# EAGLE design Right bottom 4 leds (EAGLE 8.2.0)
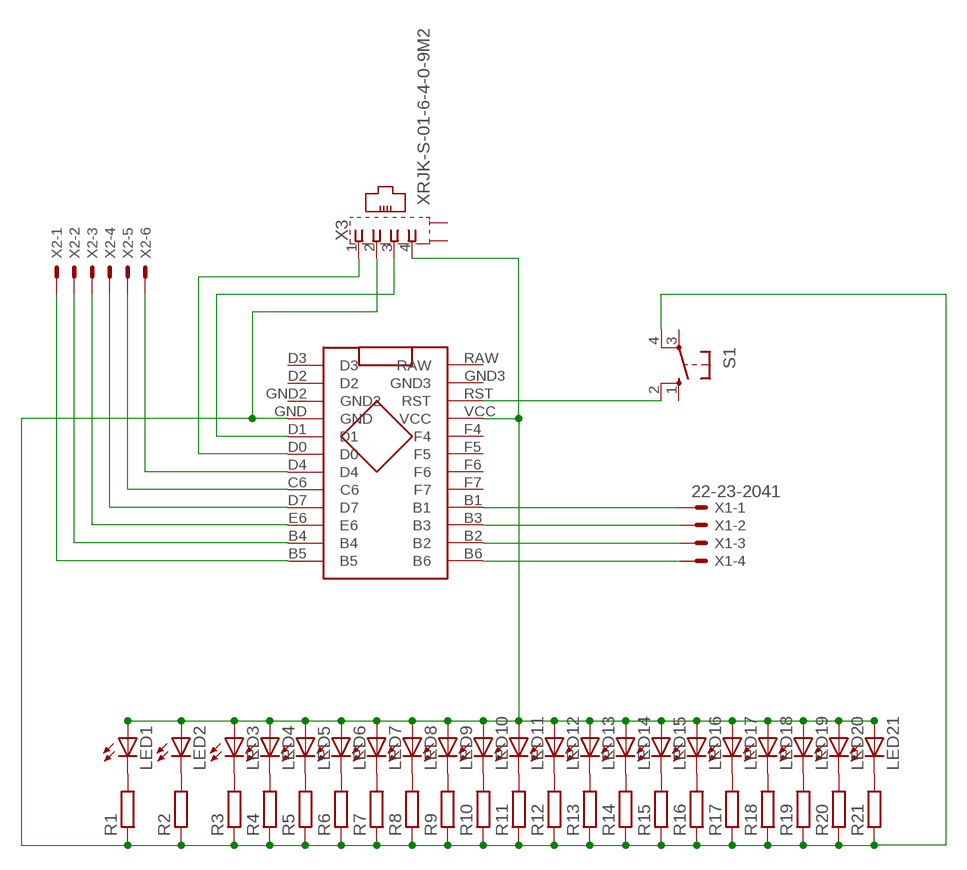
[diagram p0: schematic, sheet 1]

## Parts
LED1  LED3MM  [LED3MM]
LED2  LED3MM  [LED3MM]
LED3  LED3MM  [LED3MM]
LED4  LED3MM  [LED3MM]
LED5  LED3MM  [LED3MM]
LED6  LED3MM  [LED3MM]
LED7  LED3MM  [LED3MM]
LED8  LED3MM  [LED3MM]
LED9  LED3MM  [LED3MM]
LED10  LED3MM  [LED3MM]
LED11  LED3MM  [LED3MM]
LED12  LED3MM  [LED3MM]
LED13  LED3MM  [LED3MM]
LED14  LED3MM  [LED3MM]
LED15  LED3MM  [LED3MM]
LED16  LED3MM  [LED3MM]
LED17  LED3MM  [LED3MM]
LED18  LED3MM  [LED3MM]
LED19  LED3MM  [LED3MM]
LED20  LED3MM  [LED3MM]
LED21  LED3MM  [LED3MM]
R1  R-EU_0204/7  [0204/7]
R2  R-EU_0204/7  [0204/7]
R3  R-EU_0204/7  [0204/7]
R4  R-EU_0204/7  [0204/7]
R5  R-EU_0204/7  [0204/7]
R6  R-EU_0204/7  [0204/7]
R7  R-EU_0204/7  [0204/7]
R8  R-EU_0204/7  [0204/7]
R9  R-EU_0204/7  [0204/7]
R10  R-EU_0204/7  [0204/7]
R11  R-EU_0204/7  [0204/7]
R12  R-EU_0204/7  [0204/7]
R13  R-EU_0204/7  [0204/7]
R14  R-EU_0204/7  [0204/7]
R15  R-EU_0204/7  [0204/7]
R16  R-EU_0204/7  [0204/7]
R17  R-EU_0204/7  [0204/7]
R18  R-EU_0204/7  [0204/7]
R19  R-EU_0204/7  [0204/7]
R20  R-EU_0204/7  [0204/7]
R21  R-EU_0204/7  [0204/7]
S1  10-XX  [B3F-10XX]
U$1  ARDUINO_PRO_MICRO_HECTOR  [ARDUINO_PRO_MICRO_HECTOR]
X1  22-23-2041  [22-23-2041]
X2  22-23-2061  [22-23-2061]
X3  XRJK-S-01-6-4-0-9M2  [XRJK-S-01-6-4-0-9M2]

## Nets
N$1: LED3.K(C) R3.2
N$2: LED4.K(C) R4.2
N$3: LED5.K(C) R5.2
N$4: LED2.K(C) R2.2
N$5: LED1.K(C) R1.2
N$6: LED6.K(C) R6.2
N$7: LED7.K(C) R7.2
N$8: LED8.K(C) R8.2
N$9: LED9.K(C) R9.2
N$10: LED10.K(C) R10.2
N$11: LED11.K(C) R11.2
N$12: LED12.K(C) R12.2
N$13: LED13.K(C) R13.2
N$14: LED14.K(C) R14.2
N$15: LED15.K(C) R15.2
N$16: LED16.K(C) R16.2
N$17: LED17.K(C) R17.2
N$18: LED18.K(C) R18.2
N$19: LED19.K(C) R19.2
N$20: LED20.K(C) R20.2
N$21: LED21.K(C) R21.2
N$22: S1.2(S1) U$1.RST
N$26: U$1.B5 X2.1
N$27: U$1.B4 X2.2
N$28: U$1.E6 X2.3
N$29: U$1.D7 X2.4
N$30: U$1.C6 X2.5
N$31: U$1.D4 X2.6
N$32: U$1.D0 X3.1
N$33: U$1.D1 X3.3
N$34: R1.1 R2.1 R3.1 R4.1 R5.1 R6.1 R7.1 R8.1 R9.1 R10.1 R11.1 R12.1 R13.1 R14.1 R15.1 R16.1 R17.1 R18.1 R19.1 R20.1 R21.1 S1.4(P1) U$1.GND X3.2
N$35: LED1.A LED2.A LED3.A LED4.A LED5.A LED6.A LED7.A LED8.A LED9.A LED10.A LED11.A LED12.A LED13.A LED14.A LED15.A LED16.A LED17.A LED18.A LED19.A LED20.A LED21.A U$1.VCC X3.4
N$37: U$1.B6 X1.4
N$38: U$1.B2 X1.3
N$39: U$1.B3 X1.2
N$40: U$1.B1 X1.1
Unconnected: S1.1(S) S1.3(P) U$1.D2 U$1.D3 U$1.F4 U$1.F5 U$1.F6 U$1.F7 U$1.GND2 U$1.GND3 U$1.RAW X3.S1(S) X3.S2(S)

## Library data of the parts
LED1-LED21 = led:LED: LED OSRAM: - CHIPLED LG R971, LG N971, LY N971, LG Q971, LY Q971, LO R971, LY R971 LH N974, LH R974 LS Q976, LO Q976, LY Q976 LO Q996 - Hyper CHIPLED LW Q18S LB Q993, LB Q99A, LB R99A - SideLED LS A670, LO A670, LY A670, LG A670, LP A670 LB A673, LV A673, LT A673, LW A673 LH A674 LY A675 LS A676, LA A676, LO A676, LY A676, LW A676 LS A679, LY A679, LG A679 - Hyper Micro SIDELED® LS Y876, LA Y876, LO Y876, LY Y876 LT Y87S - SmartLED LW L88C, LW L88S LB L89C, LB L89S, LG L890 LS L89K, LO L89K, LY L89K LS L896, LA L896, LO L896, LY L896 - TOPLED LS T670, LO T670, LY T670, LG T670, LP T670 LSG T670, LSP T670, LSY T670, LOP T670, LYG T670 LG T671, LOG T671, LSG T671 LB T673, LV T673, LT T673, LW T673 LH T674 LS T676, LA T676, LO T676, LY T676, LB T676, LH T676, LSB T676, LW T676 LB T67C, LV T67C, LT T67C, LS T67K, LO T67K, LY T67K, LW E67C LS E67B, LA E67B, LO E67B, LY E67B, LB E67C, LV E67C, LT E67C LW T67C LS T679, LY T679, LG T679 LS T770, LO T770, LY T770, LG T770, LP T770 LB T773, LV T773, LT T773, LW T773 LH T774 LS E675, LA E675, LY E675, LS T675 LS T776, LA T776, LO T776, LY T776, LB T776 LHGB T686 LT T68C, LB T68C - Hyper Mini TOPLED® LB M676 - Mini TOPLED Santana® LG M470 LS M47K, LO M47K, LY M47K Source: http://www.osram.convergy.de LUXEON: - LUMILED® LXK2-PW12-R00, LXK2-PW12-S00, LXK2-PW14-U00, LXK2-PW14-V00 LXK2-PM12-R00, LXK2-PM12-S00, LXK2-PM14-U00 LXK2-PE12-Q00, LXK2-PE12-R00, LXK2-PE12-S00, LXK2-PE14-T00, LXK2-PE14-U00 LXK2-PB12-K00, LXK2-PB12-L00, LXK2-PB12-M00, LXK2-PB14-N00, LXK2-PB14-P00, LXK2-PB14-Q00 LXK2-PR12-L00, LXK2-PR12-M00, LXK2-PR14-Q00, LXK2-PR14-R00 LXK2-PD12-Q00, LXK2-PD12-R00, LXK2-PD12-S00 LXK2-PH12-R00, LXK2-PH12-S00 LXK2-PL12-P00, LXK2-PL12-Q00, LXK2-PL12-R00 Source: www.luxeon.com KINGBRIGHT: KA-3528ASYC Source: www.kingbright.com
R1-R21 = rcl:R-EU_: RESISTOR, European symbol
S1 = switch-omron:10-XX: OMRON SWITCH; MPN: B3F-1000; OC_FARNELL: 176432; OC_NEWARK: 36M3542
U$1 = Arduino pro micro hector:ARDUINO_PRO_MICRO_HECTOR
X1 = con-molex:22-23-2041: .100" (2.54mm) Center Header - 4 Pin; MF: MOLEX; MPN: 22-23-2041; OC_FARNELL: 1462920; OC_NEWARK: 38C0355
X2 = con-molex:22-23-2061: .100" (2.54mm) Center Header - 6 Pin; MF: MOLEX; MPN: 22-23-2061; OC_FARNELL: 1462922; OC_NEWARK: 27C1933
X3 = con-xmultiple:XRJK*4: RJ11 Connector without LED, 6 position, 4 contacts, thrue hole Source: XRJK-S-01-6-4-0-9M2(01).pdf

## Board
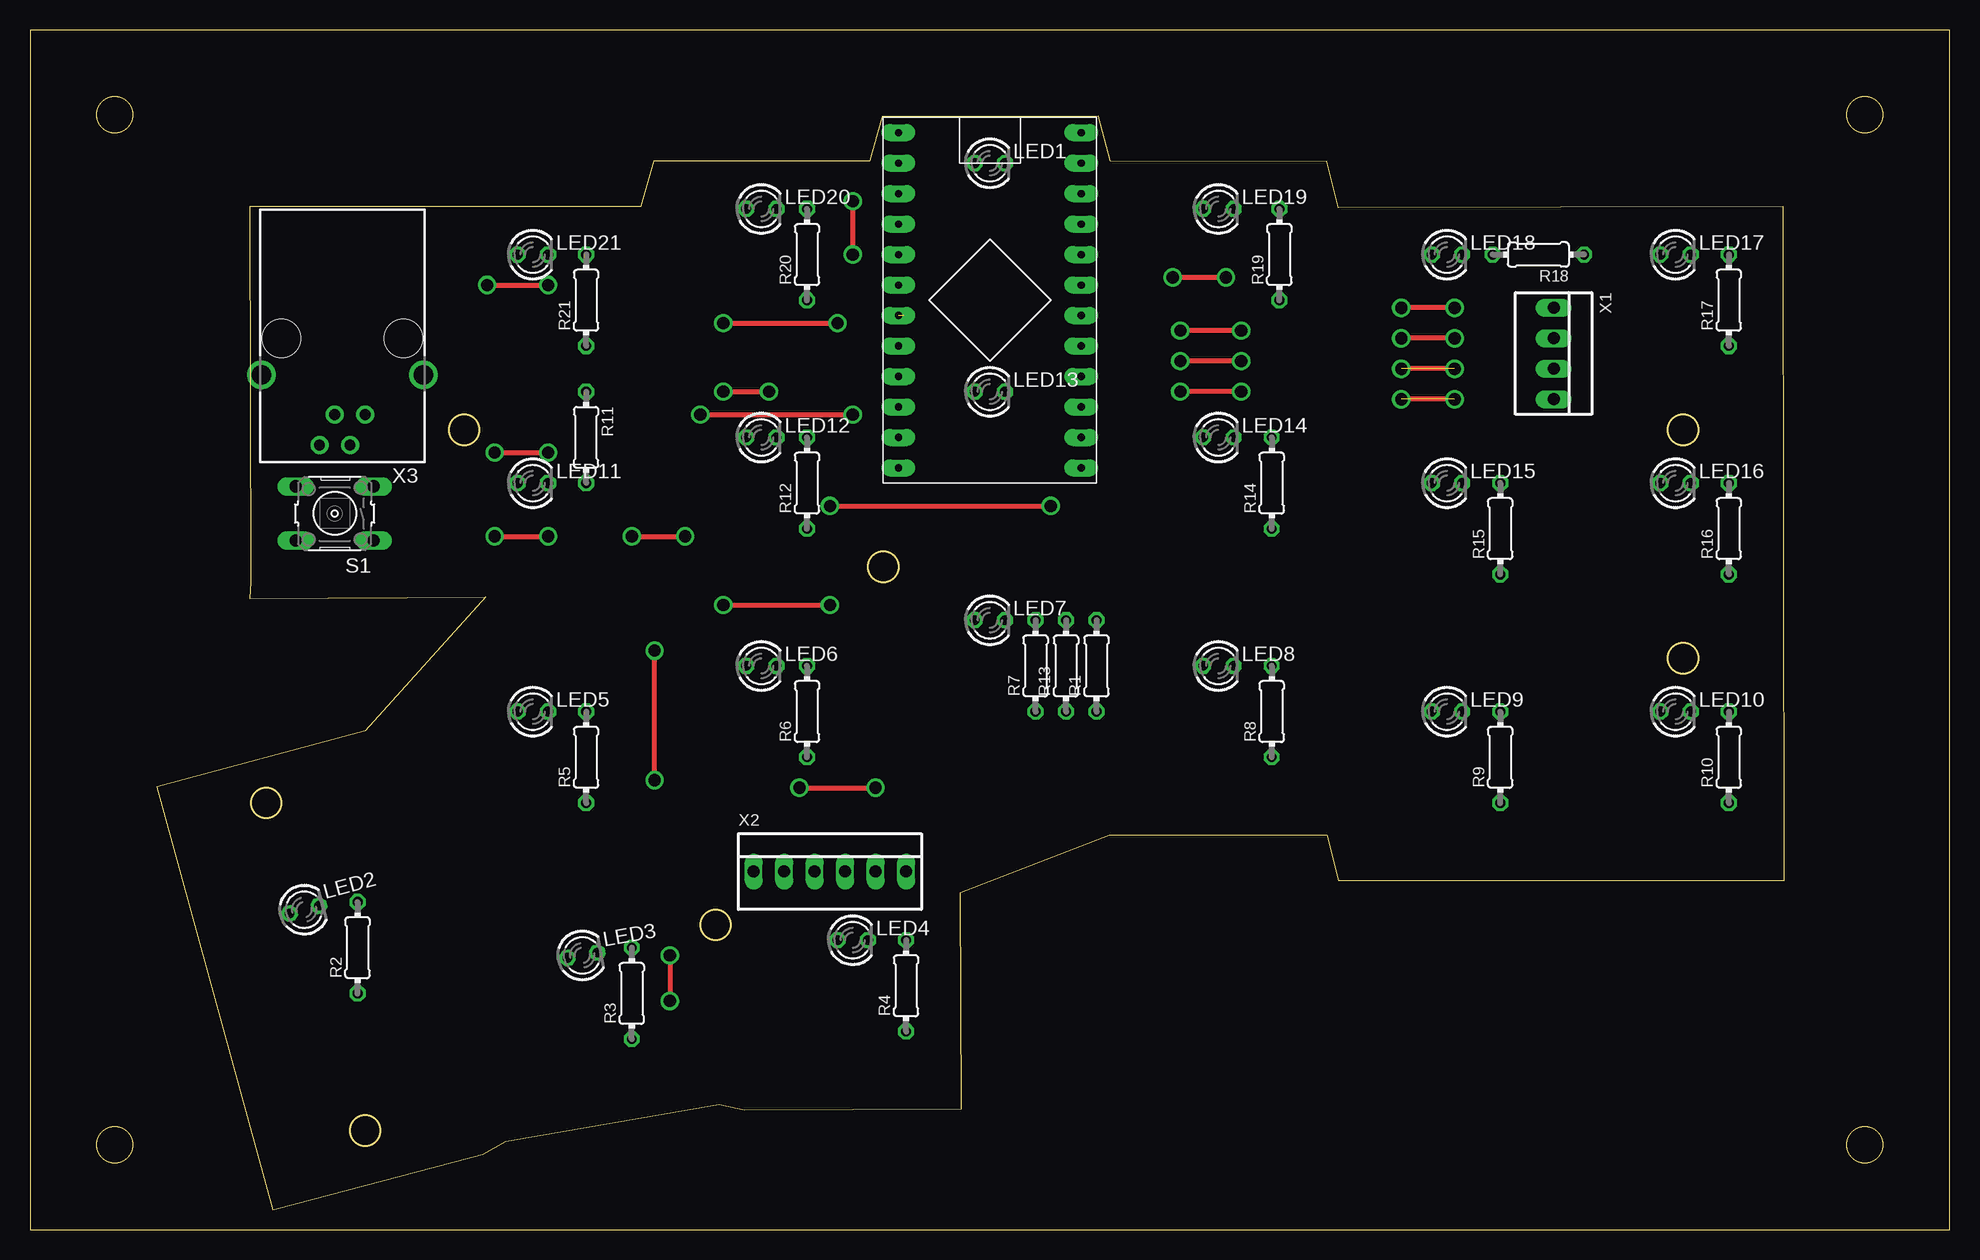
[diagram p1: board, top side]
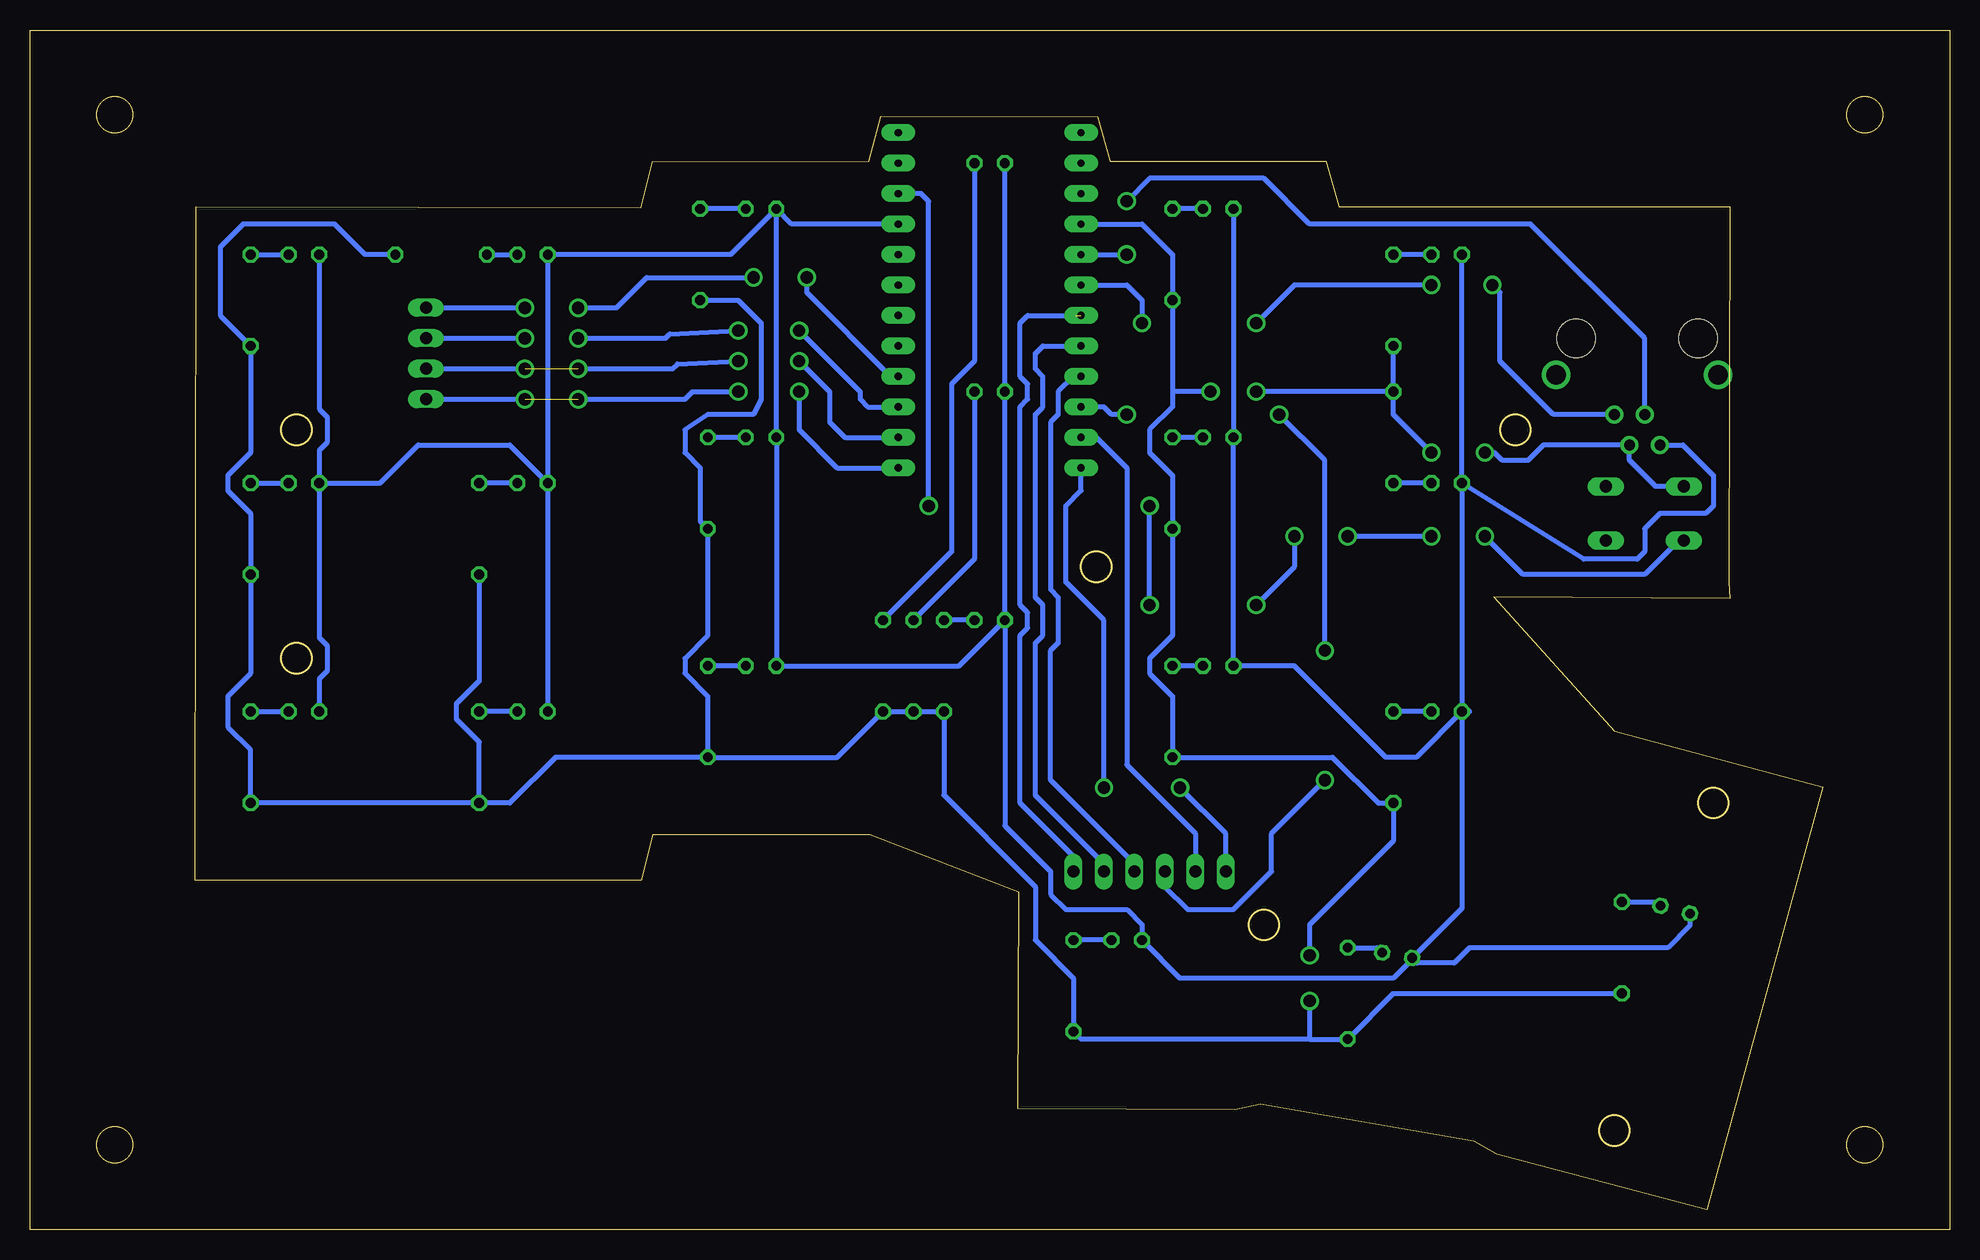
[diagram p2: board, bottom side, seen from below]

Size 160 x 100 mm. Coordinates in mm from the lower left corner, seen from the top.
Outline: 0,0 160,0 160,100 0,100 0,0
Outline: 20.25,1.66 37.71,6.28 39.63,7.34 57.43,10.42 59.58,9.99 77.64,10.05 77.58,28.11 90,32.91 108.12,32.91 109.05,29.1 146.22,29.1 146.16,85.26 109.05,85.2 108.12,89.01 90.06,89.07 89.07,92.82 71.01,92.76 69.96,89.07 51.96,89.07 50.91,85.26 18.3,85.26 18.41,53.98 18.3,52.59 37.99,52.73 27.94,41.56 10.55,36.91 20.25,1.66
Outline: circle at 7.07,92.93 radius 1.5
Outline: circle at 7.07,7.07 radius 1.5
Outline: circle at 152.93,7.07 radius 1.5
Outline: circle at 152.93,92.93 radius 1.5
Outline: circle at 71.12,55.24 radius 1.27
Outline: circle at 137.79,66.67 radius 1.27
Outline: circle at 137.79,47.62 radius 1.27
Outline: circle at 36.2,66.67 radius 1.27
Outline: circle at 19.68,35.56 radius 1.27
Outline: circle at 27.94,8.26 radius 1.27
Outline: circle at 57.15,25.4 radius 1.27
Copper layers (1*16): Top 0.035mm / dielectric 1.5mm / Bottom 0.035mm
Design rules "default *": minimum track width 6mil, minimum drill 0.35mm, track to track 12mil, track to pad 12mil, pad to pad 12mil, via to via 12mil, smd to smd 12mil, copper to edge 40mil, drill to drill 6mil, minimum pad ring 10mil, minimum via ring 8mil, stop-mask expansion 4mil, vias tented up to drill 0mil, thermal gap 10mil

### Footprints (pad centres in the part's own frame; a part is rotated, then mirrored left to right if it is on the bottom)
LED3MM = drill 0.813 octagon: A -1.27,0; K 1.27,0
0204/7 = drill 0.813 octagon: 1 -3.81,0; 2 3.81,0
B3F-10XX = drill 1.016 long: 1 -3.251,2.261; 2 3.251,2.261; 3 -3.251,-2.261; 4 3.251,-2.261
ARDUINO_PRO_MICRO_HECTOR = drill 0.6 pad 1.422 long: B1 10.16,-5.08; B2 10.16,-10.16; B3 10.16,-7.62; B4 -5.08,-10.16; B5 -5.08,-12.7; B6 10.16,-12.7; C6 -5.08,-2.54; D0 -5.08,2.54; D1 -5.08,5.08; D2 -5.08,12.7; D3 -5.08,15.24; D4 -5.08,0; D7 -5.08,-5.08; E6 -5.08,-7.62; F4 10.16,5.08; F5 10.16,2.54; F6 10.16,0; F7 10.16,-2.54; GND -5.08,7.62; GND2 -5.08,10.16; GND3 10.16,12.7; RAW 10.16,15.24; RST 10.16,10.16; VCC 10.16,7.62
22-23-2041 = drill 1 long: 1 -3.81,0; 2 -1.27,0; 3 1.27,0; 4 3.81,0
22-23-2061 = drill 1 long: 1 -6.35,0; 2 -3.81,0; 3 -1.27,0; 4 1.27,0; 5 3.81,0; 6 6.35,0
XRJK-S-01-6-4-0-9M2 = drill 0.9 pad 1.5: 1 -1.905,6.35; 2 -0.635,8.89; 3 0.635,6.35; 4 1.905,8.89 | drill 1.6 pad 2.184: S1 -6.75,3.05; S2 6.75,3.05 | hole 3.2: -5.08,0; 5.08,0

### Placement (x,y rotation side)
LED1  80.01,88.9 0 top
LED2  22.86,26.67 15 top
LED3  46.04,22.86 10 top
LED4  68.58,24.13 0 top
LED5  41.91,43.18 0 top
LED6  60.96,46.99 0 top
LED7  80.01,50.8 0 top
LED8  99.06,46.99 0 top
LED9  118.11,43.18 0 top
LED10  137.16,43.18 0 top
LED11  41.91,62.23 0 top
LED12  60.96,66.04 0 top
LED13  80.01,69.85 0 top
LED14  99.06,66.04 0 top
LED15  118.11,62.23 0 top
LED16  137.16,62.23 0 top
LED17  137.16,81.28 0 top
LED18  118.11,81.28 0 top
LED19  99.06,85.09 0 top
LED20  60.96,85.09 0 top
LED21  41.91,81.28 0 top
R1  88.9,46.99 90 top
R2  27.3,23.5 90 top
R3  50.16,19.68 90 top
R4  73.03,20.32 90 top
R5  46.35,39.37 90 top
R6  64.77,43.18 90 top
R7  83.82,46.99 90 top
R8  103.5,43.18 90 top
R9  122.56,39.37 90 top
R10  141.6,39.37 90 top
R11  46.35,66.04 270 top
R12  64.77,62.23 90 top
R13  86.36,46.99 90 top
R14  103.5,62.23 90 top
R15  122.56,58.42 90 top
R16  141.6,58.42 90 top
R17  141.6,77.47 90 top
R18  125.73,81.28 180 top
R19  104.14,81.28 90 top
R20  64.77,81.28 90 top
R21  46.35,77.47 90 top
S1  25.4,59.69 180 top
U$1  77.47,76.2 0 top
X1  127,73.03 270 top
X2  66.67,29.84 0 top
X3  26.04,74.3 180 top

### Tracks (layer width: path | path; a pad name or v marks a point on that pad's centre or on a via)
N$1
  Bottom 0.406: R3.2 47.7,23.5 LED3.K
N$2
  Bottom 0.406: LED4.K R4.2
N$3
  Bottom 0.406: LED5.K R5.2
N$4
  Bottom 0.406: R2.2 24.39,27.3 LED2.K
N$5
  Bottom 0.406: LED1.K 81.28,72.39 83.19,70.48 83.19,56.52 R1.2
N$6
  Bottom 0.406: LED6.K R6.2
N$7
  Bottom 0.406: LED7.K R7.2
N$8
  Bottom 0.406: LED8.K R8.2
N$9
  Bottom 0.406: LED9.K R9.2
N$10
  Bottom 0.406: R10.2 LED10.K
N$11
  Bottom 0.406: LED11.K R11.2
N$12
  Bottom 0.406: LED12.K R12.2
N$13
  Bottom 0.406: LED13.K 81.28,55.88 R13.2
N$14
  Bottom 0.406: LED14.K R14.2
N$15
  Bottom 0.406: LED15.K R15.2
N$16
  Bottom 0.406: R16.2 LED16.K
N$17
  Bottom 0.406: R17.2 LED17.K
N$18
  Bottom 0.406: R18.2 LED18.K
N$19
  Bottom 0.406: LED19.K R19.2
N$20
  Bottom 0.406: LED20.K R20.2
N$21
  Bottom 0.406: LED21.K R21.2
N$22  (via drill 1.02)
  Top 0.406: v38.73,57.78 v43.18,57.78 | v50.16,57.78 v54.61,57.78 | v57.78,52.07 v66.67,52.07 | v66.67,60.33 v85.09,60.33
  Bottom 0.406: S1.2 22.58,57.43 25.4,54.61 35.56,54.61 v38.73,57.78 | v43.18,57.78 v50.16,57.78 | v54.61,57.78 54.61,55.24 v57.78,52.07 | v66.67,52.07 v66.67,60.33 | v85.09,60.33 85.09,85.72 85.72,86.36 U$1.RST
N$23  (2 unrouted)
N$24  (1 unrouted)
N$26  (via drill 1.02)
  Top 0.406: v64.14,36.83 v70.48,36.83
  Bottom 0.406: X2.1 60.33,33.02 v64.14,36.83 | v70.48,36.83 70.48,50.8 73.66,53.98 73.66,60.33 72.39,61.59 U$1.B5
N$27
  Bottom 0.406: U$1.B4 71.12,66.04 68.58,63.5 68.58,38.73 62.87,33.02 X2.2
N$28  (via drill 1.02)
  Top 0.406: v52.07,37.47 v52.07,48.26 | v55.88,67.94 v68.58,67.94
  Bottom 0.406: X2.3 65.41,28.57 63.5,26.67 59.69,26.67 56.52,29.84 56.52,33.02 v52.07,37.47 | v52.07,48.26 52.07,64.14 v55.88,67.94 | v68.58,67.94 69.85,67.94 70.48,68.58 U$1.E6
N$29
  Bottom 0.406: U$1.D7 73.03,71.12 74.3,69.85 74.3,67.94 74.93,67.31 74.93,53.34 74.3,52.7 74.3,48.9 74.93,48.26 74.93,37.47 67.94,30.48 X2.4
N$30
  Bottom 0.406: X2.5 70.48,30.48 76.2,36.2 76.2,48.9 75.56,49.53 75.56,52.07 76.2,52.7 76.2,67.94 75.56,68.58 75.56,71.12 76.2,71.75 76.2,73.03 75.56,73.66 U$1.C6
N$31  (1 unrouted)
  Bottom 0.406: X2.6 73.03,31.11 77.47,35.56 77.47,49.53 76.83,50.16 76.83,51.44 77.47,52.07 77.47,68.58 76.83,69.22 76.83,70.48 77.47,71.12 77.47,75.56 76.83,76.2 72.84,76.2
N$32  (via drill 1.02)
  Top 0.406: v38.1,78.74 v43.18,78.74 | v57.78,75.56 v67.31,75.56
  Bottom 0.406: X3.1 33.02,67.94 37.47,72.39 37.47,78.11 v38.1,78.74 | v43.18,78.74 54.61,78.74 v57.78,75.56 | U$1.D0 68.58,78.74 67.31,77.47 v67.31,75.56
N$33  (via drill 1.02)
  Top 0.406: v68.58,85.72 v68.58,81.28
  Bottom 0.406: X3.3 25.4,74.3 34.92,83.82 53.34,83.82 57.15,87.63 66.67,87.63 v68.58,85.72 | U$1.D1 v68.58,81.28
N$34  (via drill 1.02)
  Top 0.406: v53.34,22.86 v53.34,19.05 | v57.78,69.85 v61.59,69.85 | v38.73,64.77 v43.18,64.77
  Bottom 0.406: R8.1 103.5,44.45 105.41,46.35 105.41,47.62 103.5,49.53 R14.1 104.14,59.05 104.14,63.5 105.41,64.77 105.41,66.67 103.5,67.94 99.69,67.94 99.06,69.22 99.06,75.56 100.97,77.47 R19.1 | R18.1 132.08,81.28 134.62,83.82 142.24,83.82 144.15,81.92 144.15,76.2 R17.1 141.6,64.77 143.51,62.87 143.51,61.59 141.6,59.69 R16.1 141.6,46.35 143.51,44.45 143.51,41.91 141.6,40.01 R10.1 R9.1 | R15.1 122.56,45.72 124.46,43.81 124.46,42.55 122.56,40.64 R9.1 | R8.1 116.2,39.37 120.02,35.56 R9.1 | R8.1 92.71,39.37 R1.1 R13.1 R7.1 83.82,36.22 76.67,29.07 76.65,29.02 76.2,28.57 76.2,24.13 73.03,20.95 R4.1 72.39,15.88 53.34,15.88 | R11.1 R21.1 | R2.1 46.35,19.68 R3.1 53.34,15.88 | 64.77,69.85 R20.1 64.77,81.28 67.31,83.82 U$1.GND | 64.77,69.85 64.77,68.58 66.67,66.67 66.67,64.77 64.77,62.87 R12.1 64.77,49.53 66.67,47.62 66.67,46.35 64.77,44.45 R6.1 51.44,39.37 47.62,35.56 R5.1 46.35,32.38 53.34,25.4 v53.34,22.86 | S1.4 24.49,61.95 26.67,64.14 X3.2 33.84,65.41 35.13,64.11 37.26,64.11 37.92,64.77 v38.73,64.77 | v53.34,19.05 53.34,15.88 | R11.1 v57.78,69.85 | v61.59,69.85 64.77,69.85 | v43.18,64.77 46.35,67.94 R11.1
N$35
  Bottom 0.406: LED19.A LED14.A LED8.A 82.55,46.99 LED7.A | LED15.A LED18.A 101.6,81.28 LED19.A | LED17.A 135.89,68.4 135.23,67.74 135.23,65.61 135.89,64.95 LED16.A | LED16.A 135.89,49.35 135.23,48.69 135.23,46.56 135.89,45.9 LED10.A | LED11.A LED21.A | LED11.A 40.64,43.81 40.01,43.18 LED5.A | LED5.A 40.64,26.79 LED3.A | LED2.A 21.63,25.36 23.5,23.5 40.01,23.5 41.27,22.23 44.37,22.23 LED3.A | LED20.A LED12.A LED6.A 54.61,46.99 46.99,39.37 44.45,39.37 LED5.A | LED15.A LED9.A | LED7.A LED13.A LED1.A | LED16.A 130.81,62.23 127.64,65.41 120.02,65.41 LED15.A | LED3.A 44.79,22.52 46.35,20.95 64.14,20.95 LED4.A 67.31,25.4 68.58,26.67 73.66,26.67 74.93,27.94 74.93,29.84 78.74,33.66 LED7.A | X3.4 22.23,65.41 19.68,62.87 19.68,60.33 20.32,59.69 24.13,59.69 25.4,58.42 25.4,56.52 26.04,55.88 30.48,55.88 LED11.A | U$1.VCC 96.52,83.82 LED19.A
N$37  (via drill 1.02)
  Top 0.406: v118.75,69.22 v114.3,69.22 | v100.97,69.85 v95.89,69.85
  Bottom 0.406: X1.4 v118.75,69.22 | v114.3,69.22 105.41,69.22 104.78,69.85 v100.97,69.85 | v95.89,69.85 95.89,66.67 92.71,63.5 U$1.B6
N$38  (via drill 1.02)
  Top 0.406: v118.75,71.75 v114.3,71.75 | v100.97,72.39 v95.89,72.39
  Bottom 0.406: X1.3 v118.75,71.75 | v100.97,72.39 106.03,72.15 106.43,71.75 v114.3,71.75 | v95.89,72.39 93.34,69.85 93.34,67.31 92.08,66.04 U$1.B2
N$39  (via drill 1.02)
  Top 0.406: v118.75,74.3 v114.3,74.3 | v100.97,74.93 v95.89,74.93
  Bottom 0.406: X1.2 v118.75,74.3 | v100.97,74.93 106.67,74.66 107.03,74.3 v114.3,74.3 | v95.89,74.93 90.81,69.85 90.81,69.22 90.17,68.58 U$1.B3
N$40  (via drill 1.02)
  Top 0.406: v118.75,76.83 v114.3,76.83 | v99.69,79.38 v95.25,79.38
  Bottom 0.406: X1.1 v118.75,76.83 | v114.3,76.83 111.12,76.83 108.58,79.38 v99.69,79.38 | U$1.B1 88.27,71.12 95.25,78.11 v95.25,79.38